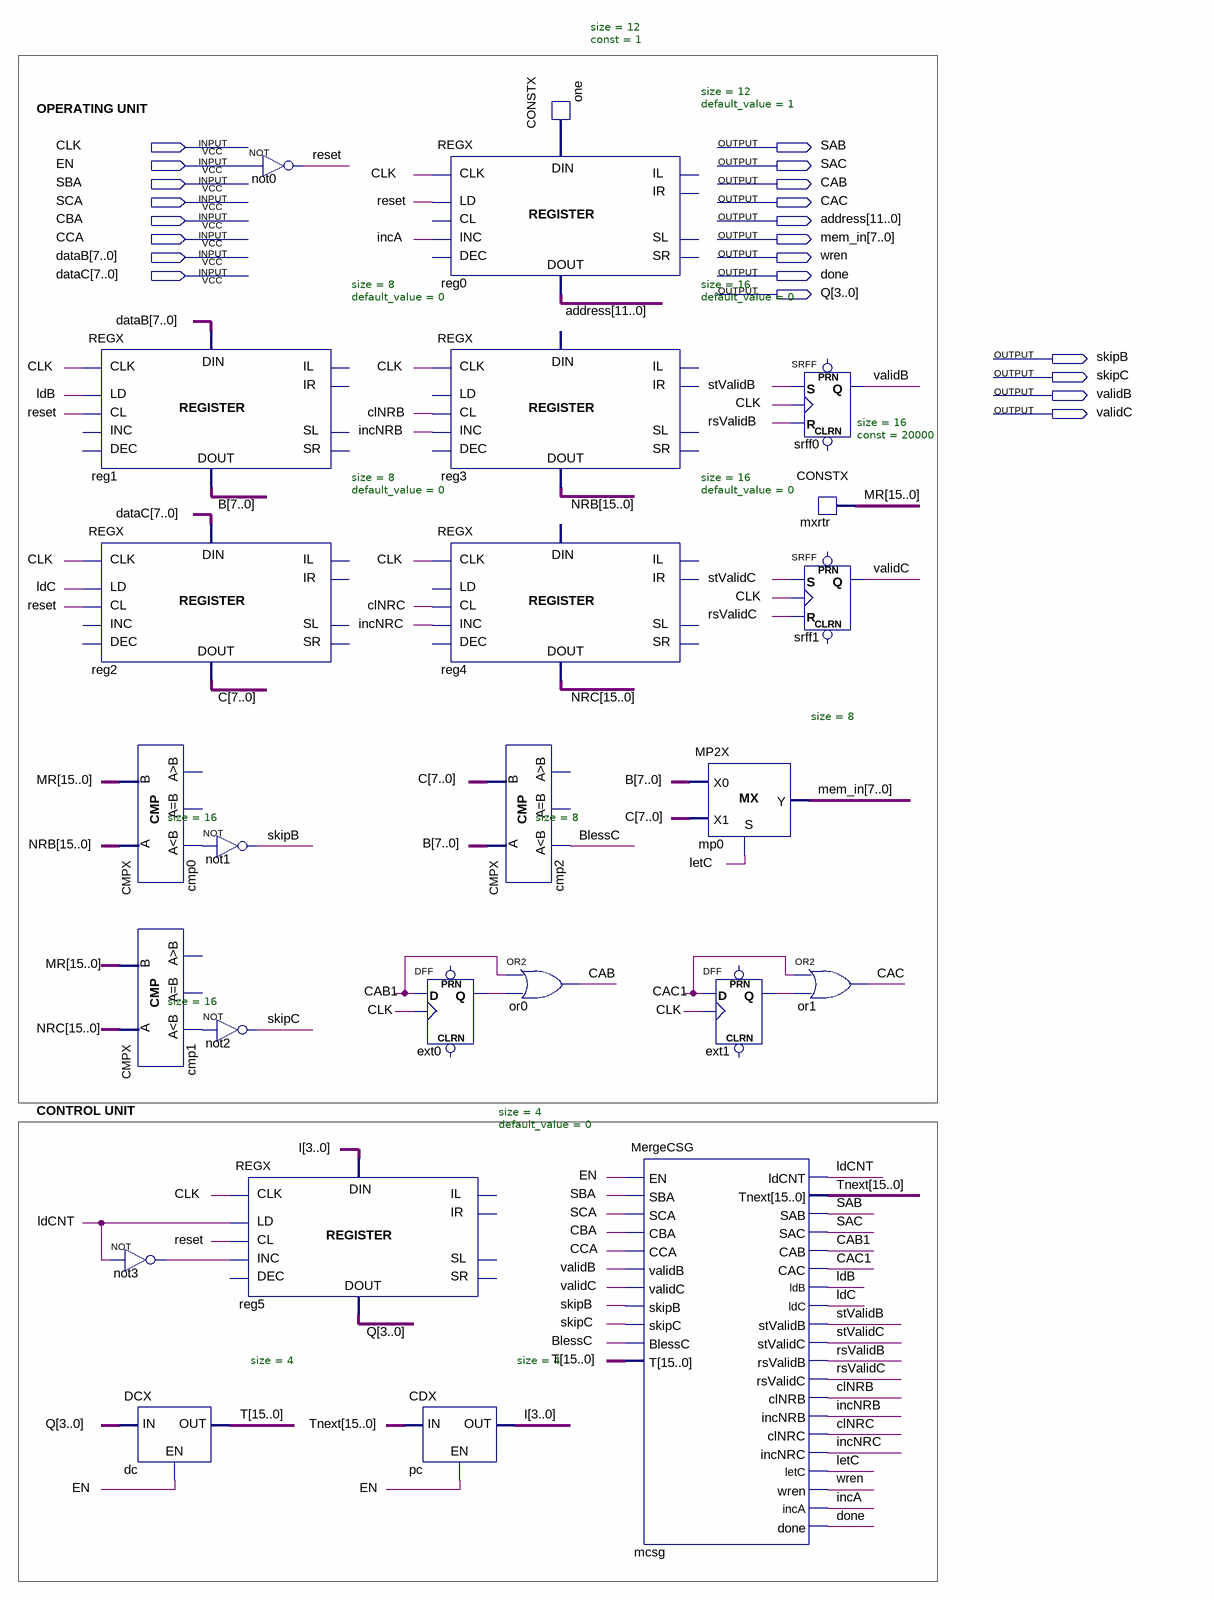
[diagram p0: schematic sheet]
// Quartus schematic Merge.bdf as structural Verilog: 25 symbols, 21 pins
module Merge (
  input  CLK,
  input  EN,
  input  SBA,
  input  SCA,
  input  CBA,
  input  CCA,
  input  [7:0] dataB,
  input  [7:0] dataC,
  output SAB,
  output SAC,
  output CAB,
  output CAC,
  output [11:0] address,
  output [7:0] mem_in,
  output wren,
  output done,
  output [3:0] Q,
  output skipB,
  output skipC,
  output validB,
  output validC
);

  wire BlessC, CAB1, CAC1, clNRB, clNRC, cmp0_ls, cmp1_ls, ext0_q, ext1_q, incA, incNRB, incNRC, ldB, ldC,
       ldCNT, letC, not3_out, reset, rsValidB, rsValidC, stValidB, stValidC;
  wire [3:0] I;
  wire [7:0] B, C;
  wire [11:0] one_data;
  wire [15:0] MR, NRB, NRC, T, Tnext;

  REGX #(.size(8), .default_value(0)) reg1 (
    .data_in(dataB), .clk(CLK), .ld(ldB), .cl(reset), .data_out(B));  // open: inc, dec, il, ir, sl, sr
  REGX #(.size(8), .default_value(0)) reg2 (
    .data_in(dataC), .clk(CLK), .ld(ldC), .cl(reset), .data_out(C));  // open: inc, dec, il, ir, sl, sr
  CMPX #(.size(16)) cmp0 (.A(NRB), .B(MR), .ls(cmp0_ls));  // open: eq, gr
  CMPX #(.size(16)) cmp1 (.A(NRC), .B(MR), .ls(cmp1_ls));  // open: eq, gr
  not not3 (not3_out, ldCNT);
  DCX #(.size(4)) dc (.EN(EN), .X(Q), .Y(T));
  not not0 (reset, EN);
  not not1 (skipB, cmp0_ls);
  not not2 (skipC, cmp1_ls);
  REGX #(.size(4), .default_value(0)) reg5 (
    .data_in(I), .clk(CLK), .ld(ldCNT), .cl(reset), .inc(not3_out), .data_out(Q));  // open: dec, il, ir, sl, sr
  REGX #(.size(12), .default_value(1)) reg0 (
    .data_in(one_data), .clk(CLK), .ld(reset), .inc(incA), .data_out(address));  // open: cl, dec, il, ir, sl, sr
  REGX #(.size(16), .default_value(0)) reg3 (
    .clk(CLK), .cl(clNRB), .inc(incNRB), .data_out(NRB));  // open: data_in, ld, dec, il, ir, sl, sr
  REGX #(.size(16), .default_value(0)) reg4 (
    .clk(CLK), .cl(clNRC), .inc(incNRC), .data_out(NRC));  // open: data_in, ld, dec, il, ir, sl, sr
  DFF ext0 (.CLK(CLK), .D(CAB1), .Q(ext0_q));  // open: CLRN, PRN
  CDX #(.size(4)) pc (.EN(EN), .X(Tnext), .Y(I));
  CONSTX #(.size(12), .\const (1)) one (.data(one_data));
  CMPX #(.size(8)) cmp2 (.A(B), .B(C), .ls(BlessC));  // open: eq, gr
  or or0 (CAB, CAB1, ext0_q);
  MP2X #(.size(8)) mp0 (.S(letC), .X0(B), .X1(C), .Y(mem_in));
  MergeCSG mcsg (
    .EN(EN), .SBA(SBA), .SCA(SCA), .CBA(CBA), .CCA(CCA), .validB(validB), .validC(validC), .skipB(skipB),
    .skipC(skipC), .BlessC(BlessC), .T(T), .ldCNT(ldCNT), .Tnext(Tnext), .SAB(SAB), .SAC(SAC), .CAB(CAB1),
    .CAC(CAC1), .ldB(ldB), .ldC(ldC), .stValidB(stValidB), .stValidC(stValidC), .rsValidB(rsValidB),
    .rsValidC(rsValidC), .clNRB(clNRB), .incNRB(incNRB), .clNRC(clNRC), .incNRC(incNRC), .letC(letC),
    .wren(wren), .incA(incA), .done(done));
  DFF ext1 (.CLK(CLK), .D(CAC1), .Q(ext1_q));  // open: CLRN, PRN
  SRFF srff0 (.S(stValidB), .R(rsValidB), .CLK(CLK), .Q(validB));  // open: PRN, CLRN
  CONSTX #(.size(16), .\const (20000)) mxrtr (.data(MR));
  SRFF srff1 (.S(stValidC), .R(rsValidC), .CLK(CLK), .Q(validC));  // open: PRN, CLRN
  or or1 (CAC, CAC1, ext1_q);

  // Notes on the sheet:
  //   OPERATING UNIT
  //   CONTROL UNIT
endmodule
